# EAGLE schematic matrix_io_board (EAGLE 6.6.0)
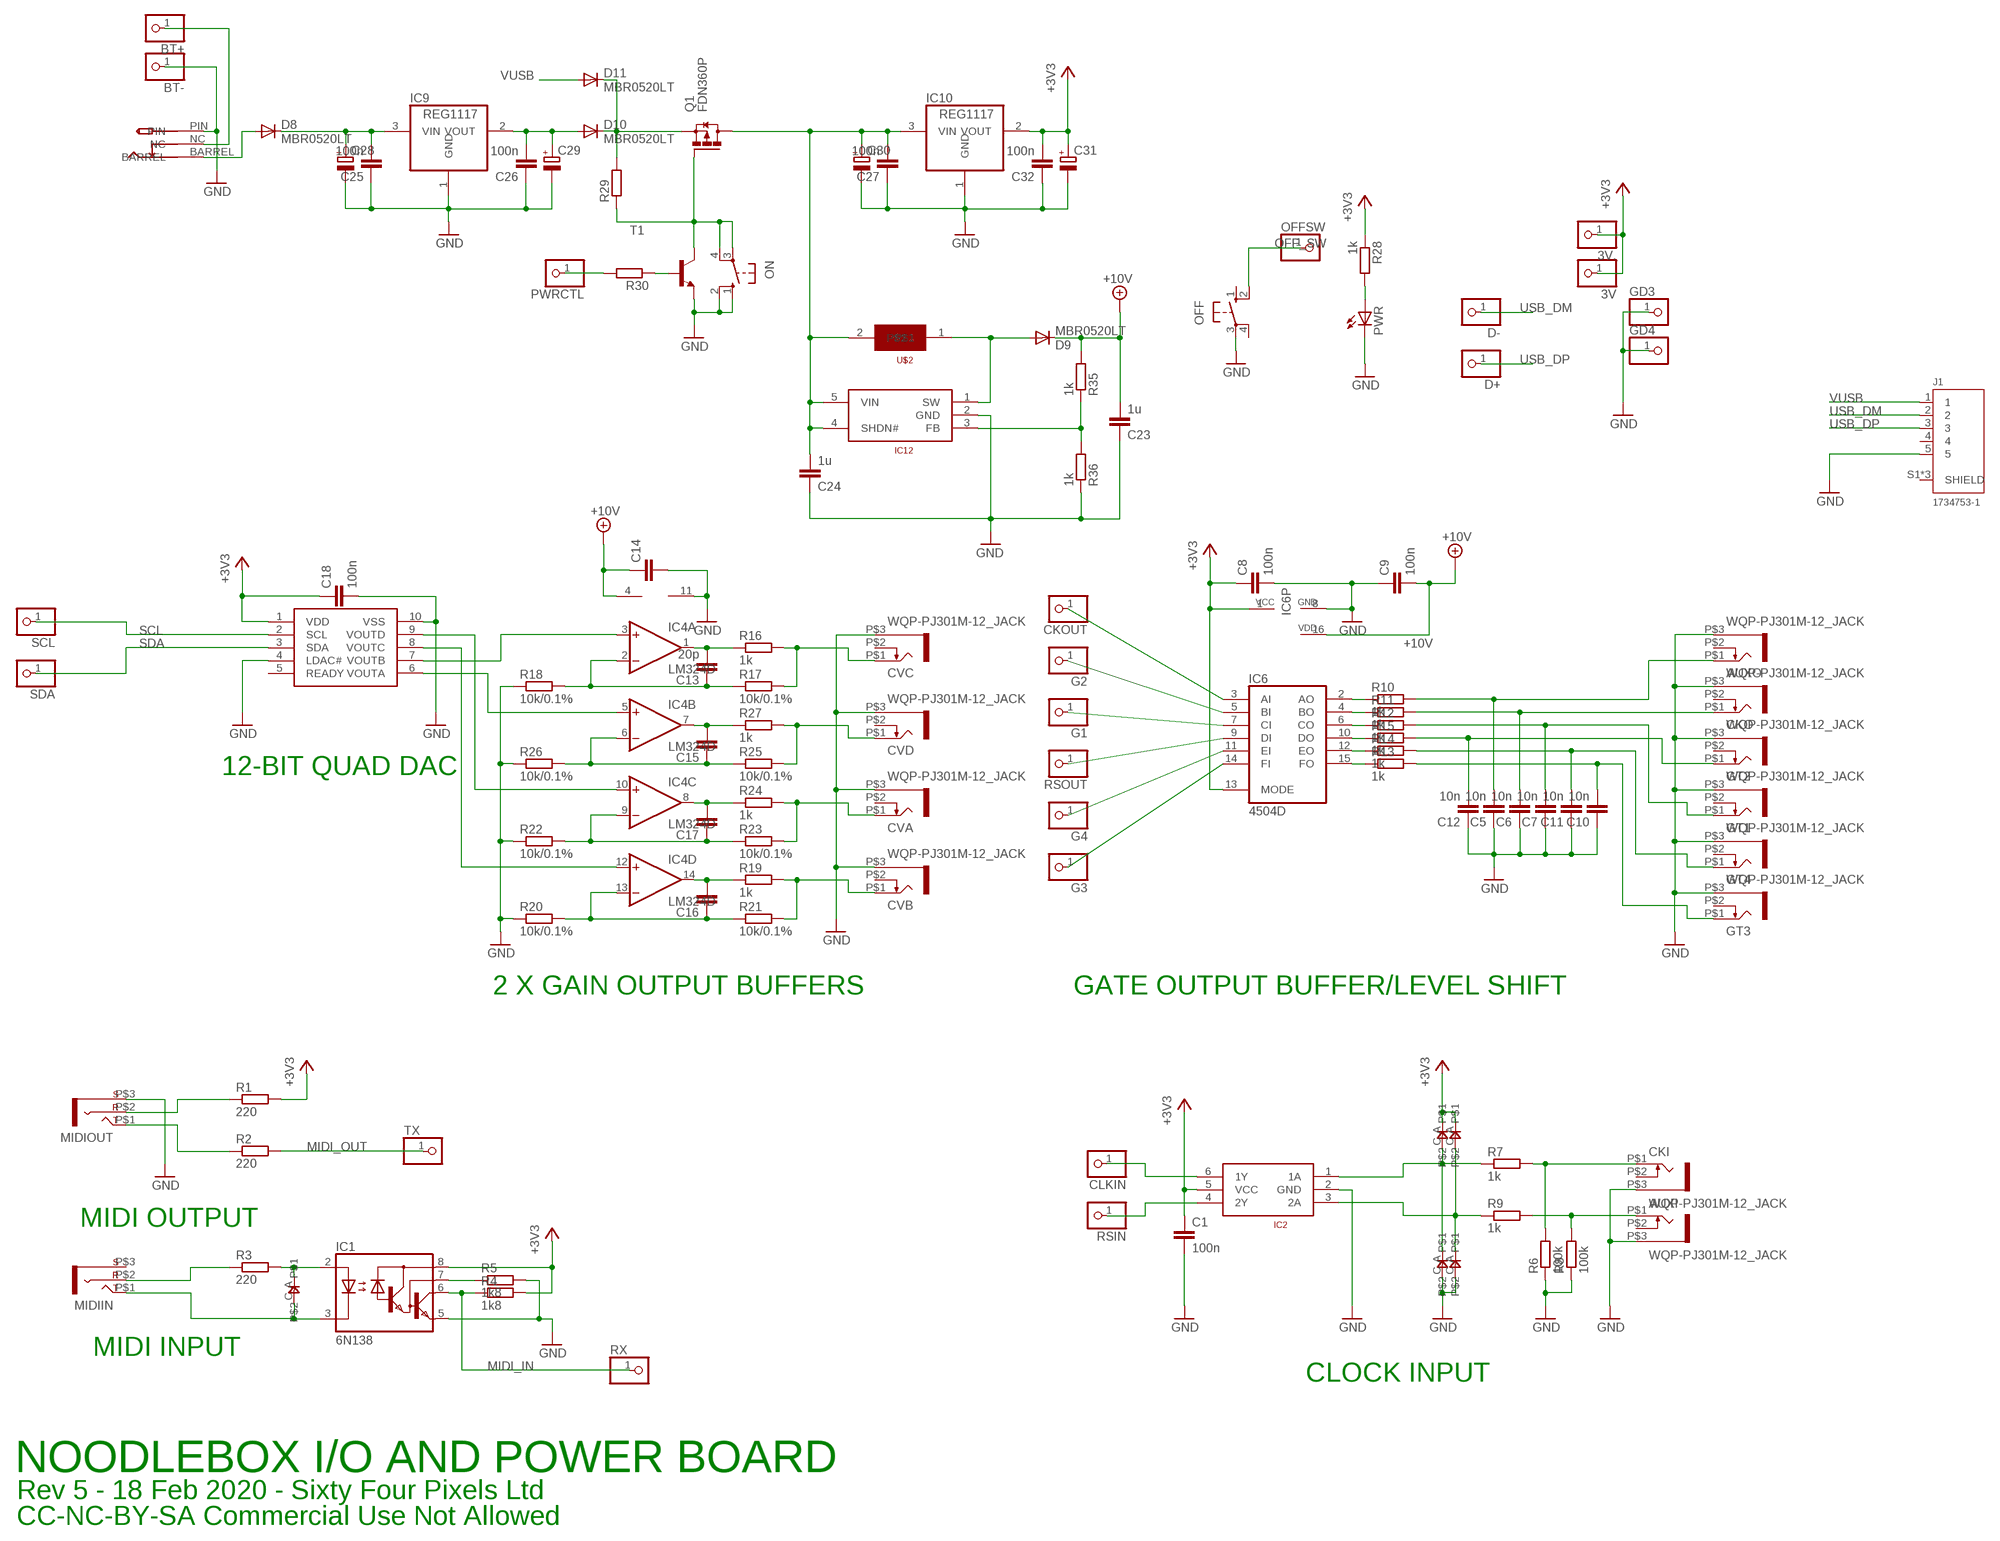
[diagram p0: schematic, sheet 1]

## Parts
3V  PINHD-1X1  [1X01]
3V.  PINHD-1X1  [1X01]
AUXI  WQP-PJ301M-12_JACK  [WQP-PJ301M-12_JACK]
AUXO  WQP-PJ301M-12_JACK  [WQP-PJ301M-12_JACK]
BT+  PINHD-1X1  [1X01]
BT-  PINHD-1X1  [1X01]
C1  100n  C-EUC0805  [C0805]
C5  10n  C-EUC0805  [C0805]
C6  10n  C-EUC0805  [C0805]
C7  10n  C-EUC0805  [C0805]
C8  100n  C-EUC0805  [C0805]
C9  100n  C-EUC0805  [C0805]
C10  10n  C-EUC0805  [C0805]
C11  10n  C-EUC0805  [C0805]
C12  10n  C-EUC0805  [C0805]
C13  20p  C-EUC0805  [C0805]
C14  C-EUC0805  [C0805]
C15  C-EUC0805  [C0805]
C16  C-EUC0805  [C0805]
C17  C-EUC0805  [C0805]
C18  100n  C-EUC0805  [C0805]
C23  1u  C-EUC0805  [C0805]
C24  1u  C-EUC0805  [C0805]
C25  100n  C-EUC0805  [C0805]
C26  100n  C-EUC0805  [C0805]
C27  100n  C-EUC0805  [C0805]
C28  CPOL-EUD  [PANASONIC_D]
C29  CPOL-EUD  [PANASONIC_D]
C30  CPOL-EUD  [PANASONIC_D]
C31  CPOL-EUD  [PANASONIC_D]
C32  100n  C-EUC0805  [C0805]
CKI  WQP-PJ301M-12_JACK  [WQP-PJ301M-12_JACK]
CKO  WQP-PJ301M-12_JACK  [WQP-PJ301M-12_JACK]
CKOUT  PINHD-1X1  [1X01]
CLKIN  PINHD-1X1  [1X01]
CVA  WQP-PJ301M-12_JACK  [WQP-PJ301M-12_JACK]
CVB  WQP-PJ301M-12_JACK  [WQP-PJ301M-12_JACK]
CVC  WQP-PJ301M-12_JACK  [WQP-PJ301M-12_JACK]
CVD  WQP-PJ301M-12_JACK  [WQP-PJ301M-12_JACK]
D1  0805DIODE  [0805DIODE]
D2  0805DIODE  [0805DIODE]
D3  0805DIODE  [0805DIODE]
D4  0805DIODE  [0805DIODE]
D5  0805DIODE  [0805DIODE]
D8  MBR0520LT  [SOD123]
D9  MBR0520LT  [SOD123]
D10  MBR0520LT  [SOD123]
D11  MBR0520LT  [SOD123]
D+  PINHD-1X1  [1X01]
D-  PINHD-1X1  [1X01]
DC  PWR_SOCKET_2_1MM  [PWR_SOCKET_2_1MM]
G1  PINHD-1X1  [1X01]
G2  PINHD-1X1  [1X01]
G3  PINHD-1X1  [1X01]
G4  PINHD-1X1  [1X01]
GD3  PINHD-1X1  [1X01]
GD4  PINHD-1X1  [1X01]
GT1  WQP-PJ301M-12_JACK  [WQP-PJ301M-12_JACK]
GT2  WQP-PJ301M-12_JACK  [WQP-PJ301M-12_JACK]
GT3  WQP-PJ301M-12_JACK  [WQP-PJ301M-12_JACK]
GT4  WQP-PJ301M-12_JACK  [WQP-PJ301M-12_JACK]
IC1  6N138  [DIL08]
IC2  SN74LVC2G14  [DBV_R-PDSO-G6]
IC4  LM324D  [SO14]
IC5  MCP4728_QUAD_DAC  [MSOP10]
IC6  4504D  [SO16]
IC9  REG1117  [SOT223]
IC10  REG1117  [SOT223]
IC12  AP3012  [SOT23-5]
J1  1734753-1  [CONN_1734753-1]
MIDIIN  THONKICONN_STEREO  [WQP-PJ301M-ST]
MIDIOUT  THONKICONN_STEREO  [WQP-PJ301M-ST]
OFF  10-XX  [B3F-10XX]
OFFSW  PINHD-1X1  [1X01]
ON  10-XX  [B3F-10XX]
PWR  LED3MM  [LED3MM]
PWRCTL  PINHD-1X1  [1X01]
Q1  FDN360P  [SUPER-SOT3]
R1  220  R-EU_R0805  [R0805]
R2  220  R-EU_R0805  [R0805]
R3  220  R-EU_R0805  [R0805]
R4  1k8  R-EU_R0805  [R0805]
R5  1k8  R-EU_R0805  [R0805]
R6  100k  R-EU_R0805  [R0805]
R7  1k  R-EU_R0805  [R0805]
R8  100k  R-EU_R0805  [R0805]
R9  1k  R-EU_R0805  [R0805]
R10  1k  R-EU_R0805  [R0805]
R11  1k  R-EU_R0805  [R0805]
R12  1k  R-EU_R0805  [R0805]
R13  1k  R-EU_R0805  [R0805]
R14  1k  R-EU_R0805  [R0805]
R15  1k  R-EU_R0805  [R0805]
R16  1k  R-EU_R0805  [R0805]
R17  10k/0.1%  R-EU_R0805  [R0805]
R18  10k/0.1%  R-EU_R0805  [R0805]
R19  1k  R-EU_R0805  [R0805]
R20  10k/0.1%  R-EU_R0805  [R0805]
R21  10k/0.1%  R-EU_R0805  [R0805]
R22  10k/0.1%  R-EU_R0805  [R0805]
R23  10k/0.1%  R-EU_R0805  [R0805]
R24  1k  R-EU_R0805  [R0805]
R25  10k/0.1%  R-EU_R0805  [R0805]
R26  10k/0.1%  R-EU_R0805  [R0805]
R27  1k  R-EU_R0805  [R0805]
R28  1k  R-EU_R0805  [R0805]
R29  R-EU_R0805  [R0805]
R30  R-EU_R0805  [R0805]
R35  1k  R-EU_R0805  [R0805]
R36  1k  R-EU_R0805  [R0805]
RSIN  PINHD-1X1  [1X01]
RSOUT  PINHD-1X1  [1X01]
RX  PINHD-1X1  [1X01]
SCL  PINHD-1X1  [1X01]
SDA  PINHD-1X1  [1X01]
T1  MMBT3904LT1-NPN-SOT23-BEC  [SOT23-BEC]
TX  PINHD-1X1  [1X01]
U$2  CDRH3D14  [CDRH3D14]

## Nets
+3V3: 3V.1 3V..1 C1.1 C8.1 C18.1 C31.+ C32.2 D3.A D4.A IC1.8(VCC) IC2.5(VCC) IC5.1(VDD) IC6.1(VCC) IC6.13(MODE) IC10.2(VOUT) R1.2 R4.2 R28.1
+10V: C9.2 C14.1 C23.2 D9.C IC4.4(P:V+) IC6.16(VDD) R35.2
AUXGATE: IC6.9(DI) RSOUT.1
CLKOUT: CKOUT.1 IC6.3(AI)
GATE1: G3.1 IC6.14(FI)
GATE2: G2.1 IC6.5(BI)
GATE3: G1.1 IC6.7(CI)
GATE4: G4.1 IC6.11(EI)
GND: AUXI.P$3 AUXO.P$3 BT-.1 C1.2 C5.1 C6.1 C7.1 C8.2 C9.1 C10.1 C11.1 C12.1 C14.2 C18.2 C23.1 C24.1 C25.1 C26.1 C27.1 C28.- C29.- C30.- C31.- C32.1 CKI.P$3 CKO.P$3 CVA.P$3 CVB.P$3 CVC.P$3 CVD.P$3 D2.C D5.C DC.PIN GD3.1 GD4.1 GT1.P$3 GT2.P$3 GT3.P$3 GT4.P$3 IC1.5(GND) IC2.2(GND) IC4.11(P:V-) IC5.4(LDAC#) IC5.10(VSS) IC6.8(GND) IC9.1(GND) IC10.1(GND) IC12.2(GND) J1.5 MIDIOUT.P$3(S) OFF.3(P) ON.1(S) ON.2(S1) PWR.K(C) R5.2 R6.1 R8.1 R18.1 R20.1 R22.1 R26.1 R36.1 T1.E
MIDI_IN: IC1.6(VO) R4.1 RX.1
MIDI_OUT: R2.2 TX.1
N$1: MIDIOUT.P$2(R) R1.1
N$2: D1.A IC1.2(A) R3.2
N$3: IC4.3(A:+IN) IC5.7(VOUTB)
N$4: D1.C IC1.3(C) MIDIIN.P$1(T)
N$5: IC1.7(VB) R5.1
N$6: MIDIOUT.P$1(T) R2.1
N$7: MIDIIN.P$2(R) R3.1
N$8: CVC.P$1 R16.2 R17.2
N$9: CVD.P$1 R25.2 R27.2
N$10: CVB.P$1 R19.2 R21.2
N$11: CVA.P$1 R23.2 R24.2
N$12: C13.2 IC4.1(A:OUT) R16.1
N$13: C15.2 IC4.7(B:OUT) R27.1
N$14: C17.2 IC4.8(C:OUT) R24.1
N$15: C16.2 IC4.14(D:OUT) R19.1
N$16: BT+.1 DC.NC
N$17: C16.1 IC4.13(D:-IN) R20.2 R21.1
N$18: C17.1 IC4.9(C:-IN) R22.2 R23.1
N$19: IC6.10(DO) R15.1
N$20: C15.1 IC4.6(B:-IN) R25.1 R26.2
N$21: C26.2 C29.+ D10.A IC9.2(VOUT)
N$22: C13.1 IC4.2(A:-IN) R17.1 R18.2
N$23: CLKIN.1 IC2.6(1Y)
N$24: AUXI.P$1 R8.2 R9.2
N$25: IC2.4(2Y) RSIN.1
N$26: D4.C D5.A IC2.3(2A) R9.1
N$27: C12.2 GT2.P$1 R15.2
N$28: D9.A IC12.1(SW) U$2.1
N$29: IC4.5(B:+IN) IC5.6(VOUTA)
N$30: IC4.10(C:+IN) IC5.9(VOUTD)
N$31: IC4.12(D:+IN) IC5.8(VOUTC)
N$32: D10.C D11.C Q1.2(S) R29.2
N$33: C24.2 C27.2 C30.+ IC10.3(VIN) IC12.4(SHDN#) IC12.5(VIN) Q1.3(D) U$2.2
N$34: ON.3(P) ON.4(P1) Q1.1(G) R29.1 T1.C
N$35: R30.1 T1.B
N$36: D8.A DC.BARREL
N$37: IC6.2(AO) R10.1
N$38: C25.2 C28.+ D8.C IC9.3(VIN)
N$40: IC6.4(BO) R11.1
N$41: IC6.6(CO) R12.1
N$42: PWRCTL.1 R30.2
N$43: IC6.12(EO) R14.1
N$44: AUXO.P$1 C5.2 R10.2
N$45: C6.2 CKO.P$1 R11.2
N$46: C7.2 GT1.P$1 R12.2
N$47: C11.2 GT4.P$1 R14.2
N$48: C10.2 GT3.P$1 R13.2
N$49: IC6.15(FO) R13.1
N$52: IC12.3(FB) R35.1 R36.2
N$53: D2.A D3.C IC2.1(1A) R7.1
N$54: CKI.P$1 R6.2 R7.2
N$56: PWR.A R28.2
OFF_SW: OFF.2(S1) OFFSW.1
SCL: IC5.2(SCL) SCL.1
SDA: IC5.3(SDA) SDA.1
USB_DM: D-.1 J1.2
USB_DP: D+.1 J1.3
VUSB: D11.A J1.1
Unconnected: AUXI.P$2 AUXO.P$2 CKI.P$2 CKO.P$2 CVA.P$2 CVB.P$2 CVC.P$2 CVD.P$2 GT1.P$2 GT2.P$2 GT3.P$2 GT4.P$2 IC5.5(READY) J1.4 J1.S1(SHIELD) J1.S2(SHIELD) J1.S3(SHIELD) MIDIIN.P$3(S) OFF.1(S) OFF.4(P1)

## Notes on the sheet
- 12-BIT QUAD DAC
- 2 X GAIN OUTPUT BUFFERS | GATE OUTPUT BUFFER/LEVEL SHIFT
- MIDI OUTPUT
- MIDI INPUT
- CLOCK INPUT
- NOODLEBOX I/O AND POWER BOARD
- Rev 5 - 18 Feb 2020 - Sixty Four Pixels Ltd
- CC-NC-BY-SA Commercial Use Not Allowed

## Library data of the parts
3V 3V. BT+ BT- CKOUT CLKIN D+ D- G1-G4 GD3 GD4 OFFSW PWRCTL RSIN RSOUT RX SCL SDA TX = pinhead:PINHD-1X1: PIN HEADER
AUXI AUXO CKI CKO CVA CVB CVC CVD GT1-GT4 = thonkiconn:WQP-PJ301M-12_JACK
C1 C5-C18 C23-C27 C32 = rcl:C-EU: CAPACITOR, European symbol
C28-C31 = rcl:CPOL-EU: POLARIZED CAPACITOR, European symbol
D1-D5 = jasons_stuff:0805DIODE
D8-D11 = diode:MBR0520LT: SCHOTTKY BARRIER RECTIFIER Source: http://onsemi.com .. MBR0520LT1-D.pdf
DC = jason_eagle6:PWR_SOCKET_2_1MM
IC1 = optocoupler:6N138: MOTOROLA OPTO COUPLER; MF: VISHAY/TELEFUNKEN; MPN: 6N138; OC_FARNELL: 9860150; OC_NEWARK: 35K5294
IC2 = jason_eagle6:SN74LVC2G14
IC4 = linear:LM324: OP AMP
IC5 = jason_eagle6:MCP4728_QUAD_DAC
IC6 = 45xx:4504: TTL or CMOS to CMOS hex LEVEL SHIFTER
IC9 IC10 = burr-brown:REG1117: 800mA and 1A Low Dropout (LDO) Positive Regulator 1.8V, 2.5V, 2.85V, 3.3V, 5V, and Adj; MPN: REG1117; OC_FARNELL: 1097566; OC_NEWARK: 14P6981
IC12 = jason2:AP3012
J1 = jason2:1734753-1: Conn Mini USB 2.0 Type B RCP 5 POS 0.8mm Solder ST Thru-Hole 5 Terminal 1 Port Tray Check availability <https://pricing.snapeda.com/parts/1734753-1/TE%20Connectivity/view-part?ref=eda>; AVAILABILITY: In Stock; COMMENT: 1734753-1; DESCRIPTION: Conn Mini USB 2.0 Type B RCP 5 POS 0.8mm Solder ST Thru-Hole 5 Terminal 1 Port Box/Tray; EU_ROHS_COMPLIANCE: Compliant; MF: TE Connectivity; MP: 1734753-1; PACKAGE: None; PRICE: None; PURCHASE-URL: https://pricing.snapeda.com/search/part/1734753-1/?ref=eda
MIDIIN MIDIOUT = jason_eagle6:THONKICONN_STEREO
OFF ON = switch-omron:10-XX: OMRON SWITCH; MPN: B3F-1000; OC_FARNELL: 176432; OC_NEWARK: 36M3542
PWR = led:LED: LED OSRAM: - CHIPLED LG R971, LG N971, LY N971, LG Q971, LY Q971, LO R971, LY R971 LH N974, LH R974 LS Q976, LO Q976, LY Q976 LO Q996 - Hyper CHIPLED LW Q18S LB Q993, LB Q99A, LB R99A - SideLED LS A670, LO A670, LY A670, LG A670, LP A670 LB A673, LV A673, LT A673, LW A673 LH A674 LY A675 LS A676, LA A676, LO A676, LY A676, LW A676 LS A679, LY A679, LG A679 - Hyper Micro SIDELED® LS Y876, LA Y876, LO Y876, LY Y876 LT Y87S - SmartLED LW L88C, LW L88S LB L89C, LB L89S, LG L890 LS L89K, LO L89K, LY L89K LS L896, LA L896, LO L896, LY L896 - TOPLED LS T670, LO T670, LY T670, LG T670, LP T670 LSG T670, LSP T670, LSY T670, LOP T670, LYG T670 LG T671, LOG T671, LSG T671 LB T673, LV T673, LT T673, LW T673 LH T674 LS T676, LA T676, LO T676, LY T676, LB T676, LH T676, LSB T676, LW T676 LB T67C, LV T67C, LT T67C, LS T67K, LO T67K, LY T67K, LW E67C LS E67B, LA E67B, LO E67B, LY E67B, LB E67C, LV E67C, LT E67C LW T67C LS T679, LY T679, LG T679 LS T770, LO T770, LY T770, LG T770, LP T770 LB T773, LV T773, LT T773, LW T773 LH T774 LS E675, LA E675, LY E675, LS T675 LS T776, LA T776, LO T776, LY T776, LB T776 LHGB T686 LT T68C, LB T68C - Hyper Mini TOPLED® LB M676 - Mini TOPLED Santana® LG M470 LS M47K, LO M47K, LY M47K Source: http://www.osram.convergy.de LUXEON: - LUMILED® LXK2-PW12-R00, LXK2-PW12-S00, LXK2-PW14-U00, LXK2-PW14-V00 LXK2-PM12-R00, LXK2-PM12-S00, LXK2-PM14-U00 LXK2-PE12-Q00, LXK2-PE12-R00, LXK2-PE12-S00, LXK2-PE14-T00, LXK2-PE14-U00 LXK2-PB12-K00, LXK2-PB12-L00, LXK2-PB12-M00, LXK2-PB14-N00, LXK2-PB14-P00, LXK2-PB14-Q00 LXK2-PR12-L00, LXK2-PR12-M00, LXK2-PR14-Q00, LXK2-PR14-R00 LXK2-PD12-Q00, LXK2-PD12-R00, LXK2-PD12-S00 LXK2-PH12-R00, LXK2-PH12-S00 LXK2-PL12-P00, LXK2-PL12-Q00, LXK2-PL12-R00 Source: www.luxeon.com KINGBRIGHT: KA-3528ASYC Source: www.kingbright.com
Q1 = transistor-power:FDN360P: Single P-Channel, PowerTrench (R) MOSFET Source: http://www.fairchildsemi.com/ds/FD/FDN360P.pdf
R1-R30 R35 R36 = rcl:R-EU_: RESISTOR, European symbol
T1 = transistor:*-NPN-: NPN Transistror BF959 corrected 2008.03.06
U$2 = jason2:CDRH3D14